# Altium schematic sheet Power.SchDoc
size A4
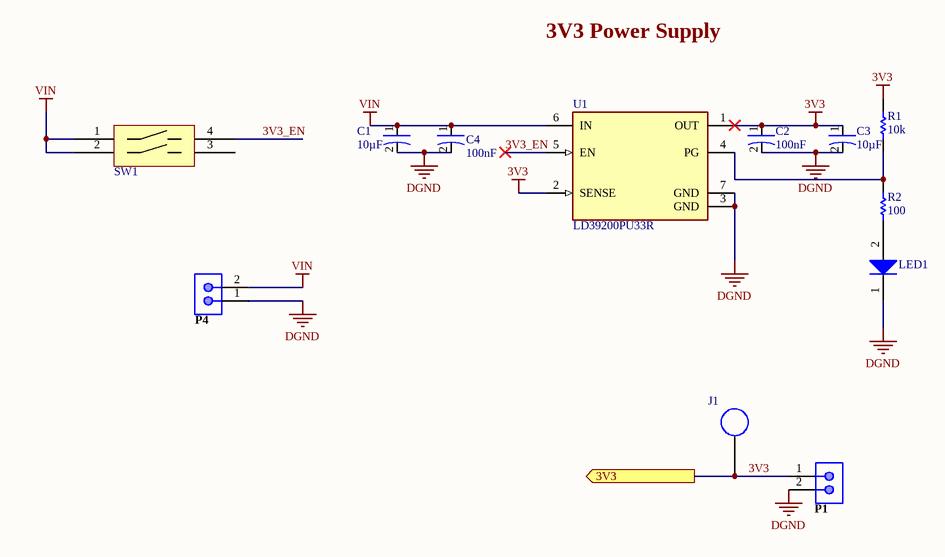
[diagram p0: Power.SchDoc]

## Parts
C1  value 10µF  [0402-M]  (hidden comment: CAP 10uF CER 0402 6.3V X5R 20%)
C2  value 100nF  [0402-M]  (hidden comment: CAP 0.1uF CER 0402 16V X5R 10%)
C3  value 10µF  [0402-M]  (hidden comment: CAP 10uF CER 0402 6.3V X5R 20%)
C4  value 100nF  [0805-M]  (hidden comment: CAP 0.1uF CER 0805 50V X7R 10%)
J1  151-203-RC  [151-203-RC-Footprint-1]  (value not drawn)
LED1  LED 0603 Green 20mA 1.8V  [0603 Generic]  (value not drawn)
P1  GENERIC 2PIN HEADER MALE  [GENERIC 2PIN HEADER 0]  (value not drawn)
P4  GENERIC 2PIN HEADER MALE  [GENERIC 2PIN HEADER 0]  (value not drawn)
R1  value 10k  [0402-M]  (hidden comment: RES 10k 0402 63mW 5%)
R2  value 100  [0805-L]  (hidden comment: RES 100 0805 125mW 1%)
SW1  210-2MS  [210-2MS-Footprint-1]  (value not drawn)
U1  LD39200PU33R  [FP-DFN6-7946637-MFG]

## Ports
3V3 (out)

## Nets
3V3: C2.1(Anode) C3.1(Anode) J1.1 P1.1 R1.2 U1.1(OUT) U1.2(SENSE) ; port 3V3
DGND: C1.2(Cathode) C2.2(Cathode) C3.2(Cathode) C4.2(Cathode) LED1.1 P1.2 P4.1 U1.3(GND) U1.7(GND)
VIN: C1.1(Anode) C4.1(Anode) P4.2 SW1.1 SW1.2 U1.6(IN)
3V3_EN: SW1.4 U1.5(EN)
NetLED1_2: LED1.2 R2.1
NetR1_1: R1.1 R2.2 U1.4(PG)

Not connected (* = marked no-connect by the designer): SW1 3(4)

## Notes on the sheet
- 3V3 Power Supply

## Library data of the parts
C1 C3 = CAP 10uF CER 0402 6.3V X5R 20%-2: CAP-10uF-CER-0402-6.3V-X5R-20%; Manufacturer: Generic; Type: SMD; Bin: F1-C2-10; Supplier Part Number 1: 80-C0402C106M9P; Source: Capacitor Library.SchLib; Case/Package: 0402; Supplier 1: Mouser; Design Item ID: CAP 10uF CER 0402 6.3V X5R 20%
C2 = CAP 0.1uF CER 0402 16V X5R 10%-2: CAP-0.1uF-CER-0402-16V-X5R-10%; Manufacturer: Generic; Bin: CAP1-M1; Type: SMD; Source: Capacitor Library.SchLib; Status: Active; Design Item ID: CAP 0.1uF CER 0402 16V X5R 10%; Supplier 1: Mouser; Supplier Part Number 1: 810-CGA2B2X5R1C104KA; Case/Package: 0402
C4 = CAP 0.1uF CER 0805 50V X7R 10%-2: CAP-0.1uF-CER-0805-50V-X7R-10%; Manufacturer: Generic; Bin: 8-CAP; Type: SMD; Source: Capacitor Library.SchLib; Status: Active; Design Item ID: CAP 0.1uF CER 0805 50V X7R 10%; Supplier 1: Mouser; Supplier Part Number 1: 80-C0805C104K5R; Case/Package: 0805; Datasheet: http://www.kemet.com/Lists/ProductCatalog/Attachments/53/KEM_C1002_X7R_SMD.pdf
J1 = CMP-002-00000-2: PCB-Probe-Ring; Color: Black
LED1 = LED 0603 Green 20mA 1.8V-1: LED-0603-Green-20mA-1.8V-STOCK; Manufacturer: Generic; Bin: F2-DM1-1; Type: SMD; Design Item ID: LED 0603 Green 20mA 1.8V; Status: Active; Supplier 1: Mouser; Supplier Part Number 1: 645-598-8060-107F; Case/Package: 0603; Source: Diode Library.SchLib
P1 P4 = GENERIC 2PIN HEADER MALE-2: CONN MAL TH 2 0Deg HEADER; Bin: B3-J5; Manufacturer: Generic; Design Item ID: GENERIC 2PIN HEADER MALE; Type: TH; Status: Active; Source: Connector Library.SchLib; Case/Package: n/a PIN
R1 = RES 10k 0402 63mW 5%-1: RES-10k-0402-63mW-5%; Manufacturer: Generic; Bin: F1-R7-9; MAPPING: 1(2,1,11.5k); Design Item ID: RES 10k 0402 63mW 5%; Type: SMD; Status: Active; Case/Package: 0402; Source: Resistor Library.SchLib
R2 = RES 100 0805 125mW 1%-1: RES-100-0805-125mW-1%; Manufacturer: Generic; Bin: F1-R11-6; MAPPING: 1(2,1,10k); Status: Active; Case/Package: 0805; Source: Resistor Library.SchLib; Type: SMD; Design Item ID: RES 100 0805 125mW 1%
SW1 = CMP-01293-3: SWITCH DIP SPST 2 100mA 50V; Actuator Type: Slide (Standard); Electrical Life: 1000Cycles; Number of Positions: 2; Washable: No; Pitch: 0.1inch; Voltage Rating (DC): 20V; Terminal Pitch: 2.54mm; Contact Material: Copper; Length: 0.258inch; Termination: PC Pin; Lead Free: Lead Free; Max Current Rating: 100mA; Throw Configuration: SPST; Packaging: Rail/Tube; Current Rating: 100mA; Orientation: Straight; Min Operating Temperature: -40°C; Contact Plating: Gold,Tin; Max Operating Temperature: 85°C; Package Quantity: 85; Mount: Through Hole
U1 = CMP-01296-4: STMICROELECTRONICS - LD39200PU33R - LDO, FIXED, 3.3V, 2A, -40 TO 125DEG C; Bin: NR; Case/Package: 6-pin DFN; Status: NR; Supplier Part Number1: NR; Manufacturer: STMicroelectronics; Type: SMD; Supplier1: NR